# Altium schematic sheet Flash.SchDoc
size A4
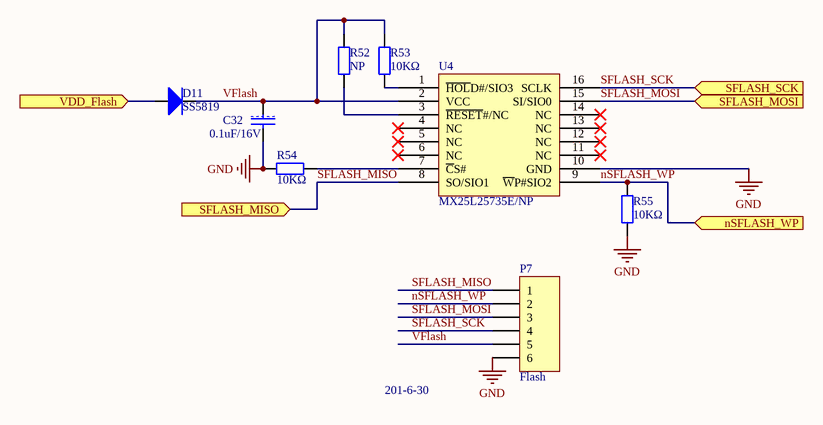
[diagram p0: Flash.SchDoc]

## Parts
C32  0.1uF/16V  [0603R]  (no BOM)
D11  SS5819  [SMA]
P7  Flash  [CON6-2.0]
R52  NP  [0603R]
R53  10KΩ  [0603R]
R54  10KΩ  [0603R]
R55  10KΩ  [0603R]
U4  MX25L25735E/NP  [SOIC16W]  (no BOM)

## Ports
nSFLASH_WP (in), SFLASH_MISO (in), SFLASH_MOSI (in), SFLASH_SCK (in), VDD_Flash (in)

## Nets
GND: C32.2 P7.6 R54.2 R55.2 U4.10(GND)
nSFLASH_WP: P7.2 R55.1 U4.9(~{W}P#SIO2) ; port nSFLASH_WP
SFLASH_MISO: P7.1 U4.8(SO/SIO1) ; port SFLASH_MISO
SFLASH_MOSI: P7.3 U4.15(SI/SIO0) ; port SFLASH_MOSI
SFLASH_SCK: P7.4 U4.16(SCLK) ; port SFLASH_SCK
VDD_Flash: D11.1(A) ; port VDD_Flash
VFlash: C32.1 D11.2(K) P7.5 R52.2 R53.2 U4.2(VCC)
NetR52_1: R52.1 U4.3(~{RESET}#/NC)
NetR53_1: R53.1 U4.1(~{HOL}D#/SIO3)
NetR54_1: R54.1 U4.7(~{C}S#)

Not connected (* = marked no-connect by the designer): U4 4(NC)* 5(NC)* 6(NC)* 11(NC)* 12(NC)* 13(NC)* 14(NC)*

## Notes on the sheet
- 201-6-30
- Drawing Name
- 图纸名称
- Drawing
- 制图
- Auditing
- 审核
- EnvMonitor
- Confirming
- 批准
- Version
- 版本号
- 小甘工作室
- V1.00
- 日期
- Date
- Jack
- XiaoGan Studio

## Library data of the parts
C32 = CAP: 贴片陶瓷电容; Kind: 贴片陶瓷电容; Author: 叶建峰
D11 = Diode 1N914: 贴片二极管; Remark: 可用1N5819替代; Kind: 贴片二极管; Author: 叶建峰
P7 = Header 6: Header, 6-Pin; LatestRevisionDate: 17-Jul-2002; LatestRevisionNote: Re-released for DXP Platform.; Publisher: Altium Limited
R52-R55 = RES_0603: OEMs: *; Type: 10KΩ; Package: 0603
U4 = MX25L25735E: SPI_flash; Manufacturer: MXIC; Kind: 集成电路; Remark: 关键元器件; 规格: 16-PIN SOP(300mil); Author: 杨杰